# Altium project LiPoKiller.PrjPcb
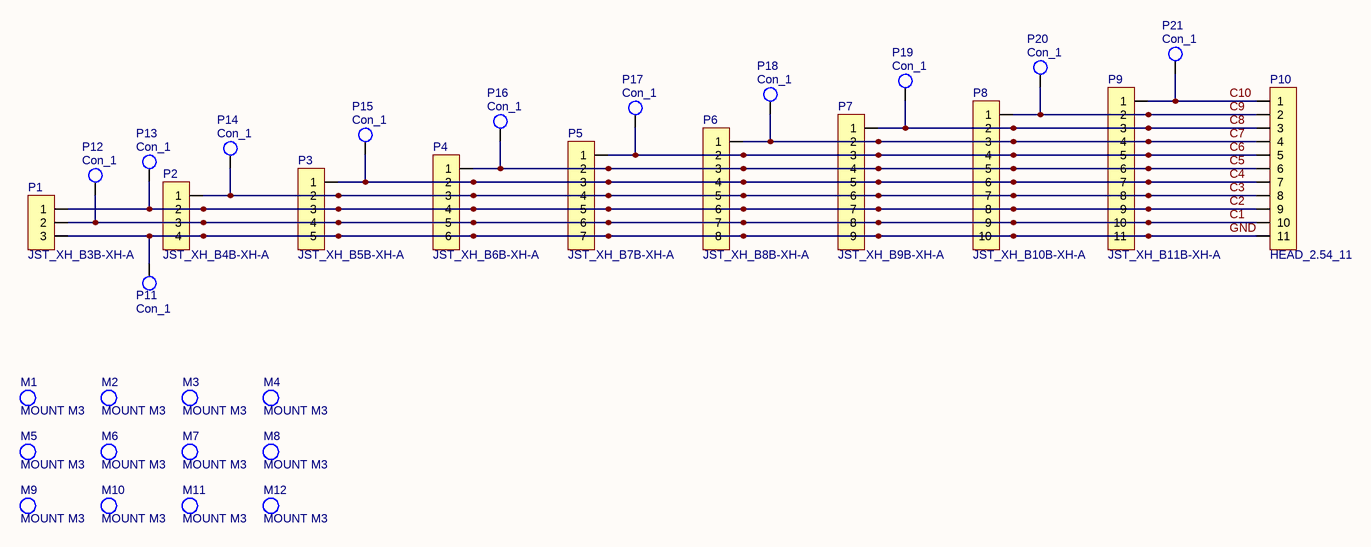
[diagram p0: LiPoKiller_Panel.SchDoc]
Author: daniw; Layout_Designer: daniw; PCB_Index: A; PCB_NAME: LK1-1; Project: LiPoKiller; Schema_Designer: daniw
1 sheet, 33 parts. Net scope: global (net labels, ports and power ports of the same name join across sheets).
Board file: LiPoKiller_Panel.PcbDoc

## Sheet LiPoKiller_Panel.SchDoc
size A4; SheetNumber: 1; SheetTotal: 1

### Parts
M1  MOUNT M3  [MOUNT_M3]
M2  MOUNT M3  [MOUNT_M3]
M3  MOUNT M3  [MOUNT_M3]
M4  MOUNT M3  [MOUNT_M3]
M5  MOUNT M3  [MOUNT_M3]
M6  MOUNT M3  [MOUNT_M3]
M7  MOUNT M3  [MOUNT_M3]
M8  MOUNT M3  [MOUNT_M3]
M9  MOUNT M3  [MOUNT_M3]
M10  MOUNT M3  [MOUNT_M3]
M11  MOUNT M3  [MOUNT_M3]
M12  MOUNT M3  [MOUNT_M3]
P1  JST_XH_B3B-XH-A  [CON_JST_XH_B3B-XH-A]
P2  JST_XH_B4B-XH-A  [CON_JST_XH_B4B-XH-A]
P3  JST_XH_B5B-XH-A  [CON_JST_XH_B5B-XH-A]
P4  JST_XH_B6B-XH-A  [CON_JST_XH_B6B-XH-A]
P5  JST_XH_B7B-XH-A  [CON_JST_XH_B7B-XH-A]
P6  JST_XH_B8B-XH-A  [CON_JST_XH_B8B-XH-A]
P7  JST_XH_B9B-XH-A  [CON_JST_XH_B9B-XH-A]
P8  JST_XH_B10B-XH-A  [CON_JST_XH_B10B-XH-A]
P9  JST_XH_B11B-XH-A  [CON_JST_XH_B11B-XH-A]
P10  HEAD_2.54_11  [CON_HEAD_2.54_11]
P11  Con_1  [Con_1_2MM_4MM]
P12  Con_1  [Con_1_2MM_4MM]
P13  Con_1  [Con_1_2MM_4MM]
P14  Con_1  [Con_1_2MM_4MM]
P15  Con_1  [Con_1_2MM_4MM]
P16  Con_1  [Con_1_2MM_4MM]
P17  Con_1  [Con_1_2MM_4MM]
P18  Con_1  [Con_1_2MM_4MM]
P19  Con_1  [Con_1_2MM_4MM]
P20  Con_1  [Con_1_2MM_4MM]
P21  Con_1  [Con_1_2MM_4MM]

### Nets
C1: P1.2 P2.3 P3.4 P4.5 P5.6 P6.7 P7.8 P8.9 P9.10 P10.10 P12.1
C2: P1.1 P2.2 P3.3 P4.4 P5.5 P6.6 P7.7 P8.8 P9.9 P10.9 P13.1
C3: P2.1 P3.2 P4.3 P5.4 P6.5 P7.6 P8.7 P9.8 P10.8 P14.1
C4: P3.1 P4.2 P5.3 P6.4 P7.5 P8.6 P9.7 P10.7 P15.1
C5: P4.1 P5.2 P6.3 P7.4 P8.5 P9.6 P10.6 P16.1
C6: P5.1 P6.2 P7.3 P8.4 P9.5 P10.5 P17.1
C7: P6.1 P7.2 P8.3 P9.4 P10.4 P18.1
C8: P7.1 P8.2 P9.3 P10.3 P19.1
C9: P8.1 P9.2 P10.2 P20.1
C10: P9.1 P10.1 P21.1
GND: P1.3 P2.4 P3.5 P4.6 P5.7 P6.8 P7.9 P8.10 P9.11 P10.11 P11.1

### Library data of the parts
M1-M12 = MOUNT M3: Mounting hole M3